# EAGLE design beteigeuze7 (EAGLE 4.16)
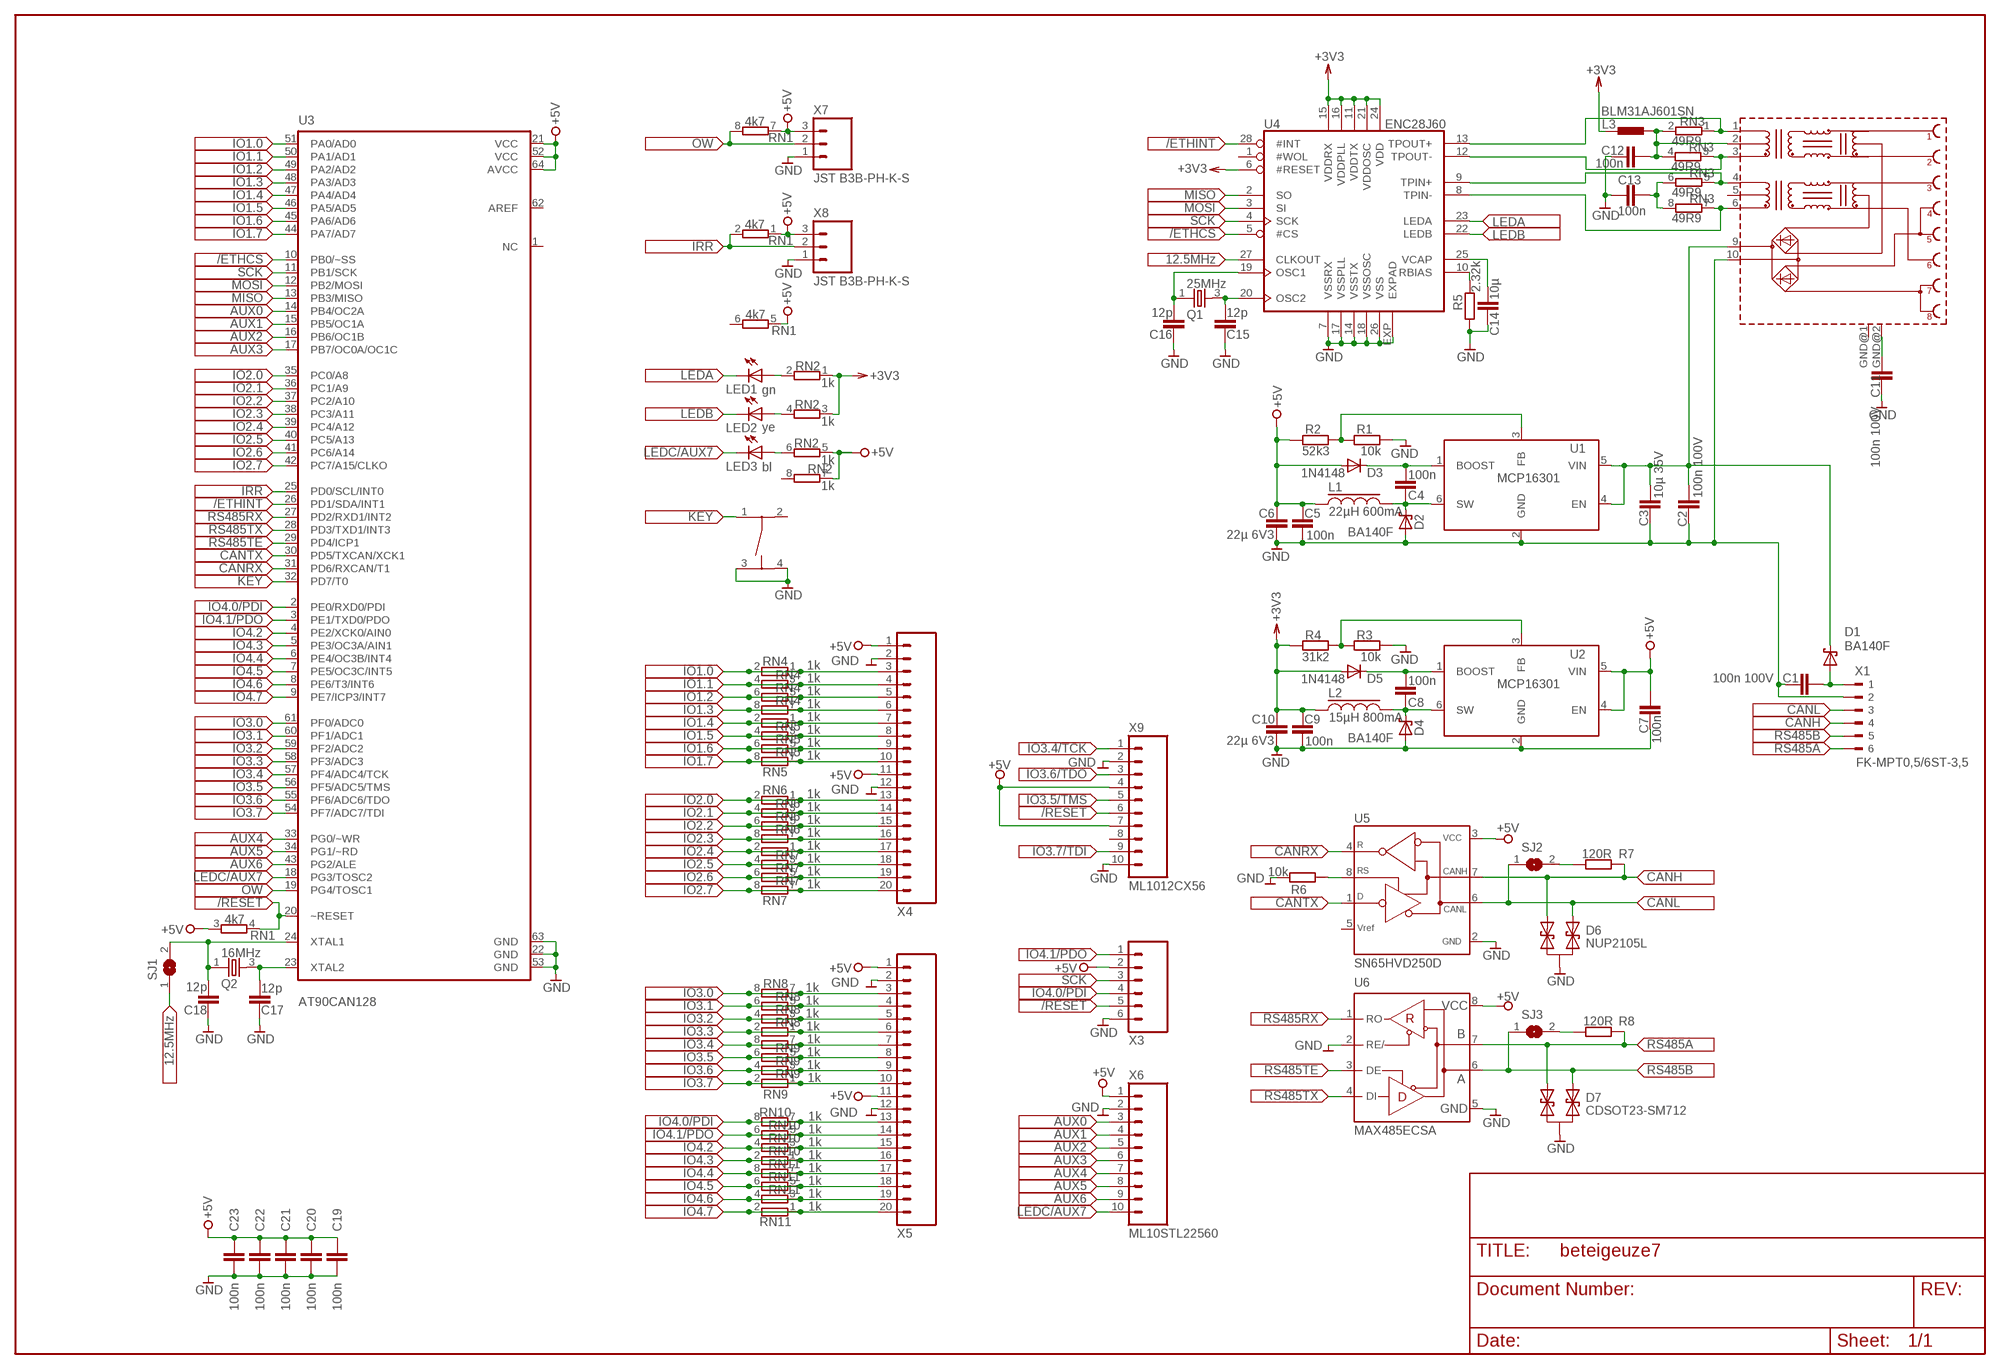
[diagram p0: schematic, sheet 1]

## Parts
C1  100n 100V  C-EUC1206  [C1206]
C2  100n 100V  C-EUC1206  [C1206]
C3  10µ 35V  C-EUC1210  [C1210]
C4  100n  C-EUC0603  [C0603]
C5  100n  C-EUC0603  [C0603]
C6  22µ 6V3  C-EUC0805  [C0805]
C7  100n  C-EUC0603  [C0603]
C8  100n  C-EUC0603  [C0603]
C9  100n  C-EUC0603  [C0603]
C10  22µ 6V3  C-EUC0805  [C0805]
C11  100n 100V  C-EUC1206  [C1206]
C12  100n  C-EUC0603  [C0603]
C13  100n  C-EUC0603  [C0603]
C14  10µ  C-EUC0603  [C0603]
C15  12p  C-EUC0603  [C0603]
C16  12p  C-EUC0603  [C0603]
C17  12p  C-EUC0603  [C0603]
C18  12p  C-EUC0603  [C0603]
C19  100n  C-EUC0603  [C0603]
C20  100n  C-EUC0603  [C0603]
C21  100n  C-EUC0603  [C0603]
C22  100n  C-EUC0603  [C0603]
C23  100n  C-EUC0603  [C0603]
D1  BA140F  SCHOTTKY-DIODESMA  [SMA]
D2  BA140F  SCHOTTKY-DIODESMA  [SMA]
D3  1N4148  DIODE-SOD323-R  [SOD323-R]
D4  BA140F  SCHOTTKY-DIODESMA  [SMA]
D5  1N4148  DIODE-SOD323-R  [SOD323-R]
D6  NUP2105L  [SOT23]
D7  CDSOT23-SM712  NUP2105L  [SOT23]
L1  22µH 600mA  SRN3015  [SRN3015]
L2  15µH 800mA  SRN3015  [SRN3015]
L3  BLM31AJ601SN  L-EUL1206  [C1206K]
LED1  gn  LEDCHIPLED_0805_GN  [CHIPLED_0805_GN]
LED2  ye  LEDCHIPLED_0805_GE  [CHIPLED_0805_GE]
LED3  bl  LEDCHIPLED_0805_BL  [CHIPLED_0805_BL]
Q1  25MHz  QXO32  [XO32]
Q2  16MHz  QXO32  [XO32]
R1  10k  R-EU_R0603  [R0603]
R2  52k3  R-EU_R0603  [R0603]
R3  10k  R-EU_R0603  [R0603]
R4  31k2  R-EU_R0603  [R0603]
R5  2.32k  R-EU_R0603  [R0603]
R6  10k  R-EU_R0603  [R0603]
R7  120R  R-EU_R0603  [R0603]
R8  120R  R-EU_R0603  [R0603]
RN1  4k7  E4RP  [BCN16]
RN2  1k  E4RP  [BCN16]
RN3  49R9  E4RP  [BCN16]
RN4  1k  E4RP  [BCN16]
RN5  1k  E4RP  [BCN16]
RN6  1k  E4RP  [BCN16]
RN7  1k  E4RP  [BCN16]
RN8  1k  E4RP  [BCN16]
RN9  1k  E4RP  [BCN16]
RN10  1k  E4RP  [BCN16]
RN11  1k  E4RP  [BCN16]
SJ1  SJN  [SJJ]
SJ2  SJN  [SJJ]
SJ3  SJN  [SJJ]
SW1  MENTOR1254PHAP3301A  [PHAP3301A]
U1  MCP16301  [SOT23-6L]
U2  MCP16301  [SOT23-6L]
U3  AT90CAN128  AT90CAN16AU  [TQFP64]
U4  ENC28J60  ENC28J60I/ML  [QNF28]
U5  SN65HVD250D  SN65HVD230DESA  [SO8]
U6  MAX485ECSA  MAX3072ECSA  [SO8]
X1  FK-MPT0,5/6ST-3,5  [FK-MPT0,5/6ST-3,5]
X2  WE7499210001AX-NUPS  [WE7499210001AX]
X3  ML6M  [STL22-560LPGGG6]
X4  ML20STL22-560  [STL22-560LPGGG20]
X5  ML20STL22-560  [STL22-560LPGGG20]
X6  ML10STL22560  [STL22-560LPGGG10]
X7  JST B3B-PH-K-S  CON03PPH-K-S  [B3B-PH-K-S]
X8  JST B3B-PH-K-S  CON03PPH-K-S  [B3B-PH-K-S]
X9  ML1012CX56  [12CX56-010G]

## Nets
12.5MHZ: SJ1.1 U4.27(CLKOUT)
+3V3: C9.2 C10.2 D5.A L2.1 L3.1 R4.2 RN2.1 RN2.3 U4.6(#RESET) U4.11(VDDTX) U4.15(VDDRX) U4.16(VDDPLL) U4.21(VDDOSC) U4.24(VDD)
+5V: C5.2 C6.2 C7.2 C19.2 C20.2 C21.2 C22.2 C23.2 D3.A L1.1 R2.2 RN1.1 RN1.3 RN1.5 RN1.7 RN2.5 RN2.7 U2.4(EN) U2.5(VIN) U3.21(VCC) U3.52(VCC) U3.64(AVCC) U5.3(VCC) U6.8(VCC) X3.2 X4.1 X4.11 X5.1 X5.11 X6.1 X7.3 X8.3 X9.4 X9.7
/ETHCS: U3.10(PB0/~SS) U4.5(#CS)
/ETHINT: U3.26(PD1/SDA/INT1) U4.28(#INT)
/RESET: RN1.4 U3.20(~RESET) X3.5 X9.6
AUX0: U3.14(PB4/OC2A) X6.3
AUX1: U3.15(PB5/OC1A) X6.4
AUX2: U3.16(PB6/OC1B) X6.5
AUX3: U3.17(PB7/OC0A/OC1C) X6.6
AUX4: U3.33(PG0/~WR) X6.7
AUX5: U3.34(PG1/~RD) X6.8
AUX6: U3.43(PG2/ALE) X6.9
BST3: C8.2 D5.C U2.1(BOOST)
BST5: C4.2 D3.C U1.1(BOOST)
CANH: D6.1 R7.2 U5.7(CANH) X1.4
CANL: D6.2 SJ2.1 U5.6(CANL) X1.3
CANRX: U3.31(PD6/RXCAN/T1) U5.4(R)
CANTX: U3.30(PD5/TXCAN/XCK1) U5.1(D)
FB3: R3.2 R4.1 U2.3(FB)
FB5: R1.2 R2.1 U1.3(FB)
GND: C1.1 C2.2 C3.1 C5.1 C6.1 C7.1 C9.1 C10.1 C11.1 C12.1 C13.1 C14.1 C15.1 C16.1 C17.1 C18.1 C19.1 C20.1 C21.1 C22.1 C23.1 D2.A D4.A D6.3 D7.3 R1.1 R3.1 R5.1 R6.2 SW1.3(A) SW1.4(A) U1.2(GND) U2.2(GND) U3.22(GND) U3.53(GND) U3.63(GND) U4.7(VSSRX) U4.14(VSSTX) U4.17(VSSPLL) U4.18(VSSOSC) U4.26(VSS) U4.EXP(EXPAD) U5.2(GND) U6.2(RE/) U6.5(GND) X1.2 X2.10(VC1-) X3.6 X4.2 X4.12 X5.2 X5.12 X6.2 X7.1 X8.1 X9.2 X9.10
IO1.0: RN4.1 RN4.2 U3.51(PA0/AD0) X4.3
IO1.1: RN4.3 RN4.4 U3.50(PA1/AD1) X4.4
IO1.2: RN4.5 RN4.6 U3.49(PA2/AD2) X4.5
IO1.3: RN4.7 RN4.8 U3.48(PA3/AD3) X4.6
IO1.4: RN5.1 RN5.2 U3.47(PA4/AD4) X4.7
IO1.5: RN5.3 RN5.4 U3.46(PA5/AD5) X4.8
IO1.6: RN5.5 RN5.6 U3.45(PA6/AD6) X4.9
IO1.7: RN5.7 RN5.8 U3.44(PA7/AD7) X4.10
IO2.0: RN6.1 RN6.2 U3.35(PC0/A8) X4.13
IO2.1: RN6.3 RN6.4 U3.36(PC1/A9) X4.14
IO2.2: RN6.5 RN6.6 U3.37(PC2/A10) X4.15
IO2.3: RN6.7 RN6.8 U3.38(PC3/A11) X4.16
IO2.4: RN7.1 RN7.2 U3.39(PC4/A12) X4.17
IO2.5: RN7.3 RN7.4 U3.40(PC5/A13) X4.18
IO2.6: RN7.5 RN7.6 U3.41(PC6/A14) X4.19
IO2.7: RN7.7 RN7.8 U3.42(PC7/A15/CLKO) X4.20
IO3.0: RN8.7 RN8.8 U3.61(PF0/ADC0) X5.3
IO3.1: RN8.5 RN8.6 U3.60(PF1/ADC1) X5.4
IO3.2: RN8.3 RN8.4 U3.59(PF2/ADC2) X5.5
IO3.3: RN8.1 RN8.2 U3.58(PF3/ADC3) X5.6
IO3.4: RN9.7 RN9.8 U3.57(PF4/ADC4/TCK) X5.7 X9.1
IO3.5: RN9.5 RN9.6 U3.56(PF5/ADC5/TMS) X5.8 X9.5
IO3.6: RN9.3 RN9.4 U3.55(PF6/ADC6/TDO) X5.9 X9.3
IO3.7: RN9.1 RN9.2 U3.54(PF7/ADC7/TDI) X5.10 X9.9
IO4.0/PDI: RN10.7 RN10.8 U3.2(PE0/RXD0/PDI) X3.4 X5.13
IO4.1/PDO: RN10.5 RN10.6 U3.3(PE1/TXD0/PDO) X3.1 X5.14
IO4.2: RN10.3 RN10.4 U3.4(PE2/XCK0/AIN0) X5.15
IO4.3: RN10.1 RN10.2 U3.5(PE3/OC3A/AIN1) X5.16
IO4.4: RN11.7 RN11.8 U3.6(PE4/OC3B/INT4) X5.17
IO4.5: RN11.5 RN11.6 U3.7(PE5/OC3C/INT5) X5.18
IO4.6: RN11.3 RN11.4 U3.8(PE6/T3/INT6) X5.19
IO4.7: RN11.1 RN11.2 U3.9(PE7/ICP3/INT7) X5.20
IRR: RN1.2 U3.25(PD0/SCL/INT0) X8.2
KEY: SW1.1(B) U3.32(PD7/T0)
LEDA: LED1.C U4.23(LEDA)
LEDB: LED2.C U4.22(LEDB)
LEDC/AUX7: LED3.C U3.18(PG3/TOSC2) X6.10
MISO: U3.13(PB3/MISO) U4.2(SO)
MOSI: U3.12(PB2/MOSI) U4.3(SI)
N$4: LED3.A RN2.6
N$7: C12.2 L3.2 RN3.2 RN3.4 X2.2(TCT)
N$8: C13.2 RN3.6 RN3.8
N$23: R6.1 U5.8(RS)
N$24: R7.1 SJ2.2
N$25: LED1.A RN2.2
N$26: R8.1 SJ3.2
N$29: LED2.A RN2.4
OSC1: C16.2 Q1.1 U4.19(OSC1)
OSC2: C15.2 Q1.3 U4.20(OSC2)
OW: RN1.8 U3.19(PG4/TOSC1) X7.2
RBIAS: R5.2 U4.10(RBIAS)
RS485A: D7.1 R8.2 U6.7(B) X1.6
RS485B: D7.2 SJ3.1 U6.6(A) X1.5
RS485RX: U3.27(PD2/RXD1/INT2) U6.1(RO)
RS485TE: U3.29(PD4/ICP1) U6.3(DE)
RS485TX: U3.28(PD3/TXD1/INT3) U6.4(DI)
SCK: U3.11(PB1/SCK) U4.4(SCK) X3.3
SHLD: C11.2 X2.GND@2(SHLD)
SW3: C8.1 D4.C L2.2 U2.6(SW)
SW5: C4.1 D2.C L1.2 U1.6(SW)
TPIN+: RN3.5 U4.9(TPIN+) X2.4(RX+)
TPIN-: RN3.7 U4.8(TPIN-) X2.6(RX-)
TPOUT+: RN3.1 U4.13(TPOUT+) X2.1(TX+)
TPOUT-: RN3.3 U4.12(TPOUT-) X2.3(TX-)
VCAP: C14.2 U4.25(VCAP)
VIN: C2.1 C3.2 D1.C U1.4(EN) U1.5(VIN) X2.9(VC1+)
VSUP: C1.2 D1.A X1.1
XTAL1: C18.2 Q2.1 SJ1.2 U3.24(XTAL1)
XTAL2: C17.2 Q2.3 U3.23(XTAL2)
Unconnected: RN1.6 RN2.8 SW1.2(B) U3.1(NC) U3.62(AREF) U4.1(#WOL) U5.5(VREF) X2.5(RCT) X2.GND@1(SHLD) X9.8

## Library data of the parts
C1-C23 = rcl:C-EU: CAPACITOR, European symbol
D1 D2 D4 = diode:SCHOTTKY-DIODE: Schottky Diode
D3 D5 = diode:DIODE-: DIODE
D6 D7 = _frank:NUP2105L
L1 L2 = inductor-bourns:SRN
L3 = rcl:L-EU: INDUCTOR, European symbol
LED1-LED3 = led:LED: LED OSRAM: - CHIPLED LG R971, LG N971, LY N971, LG Q971, LY Q971, LO R971, LY R971 LH N974, LH R974 LS Q976, LO Q976, LY Q976 LO Q996 - Hyper CHIPLED LW Q18S LB Q993, LB Q99A, LB R99A - SideLED LS A670, LO A670, LY A670, LG A670, LP A670 LB A673, LV A673, LT A673, LW A673 LH A674 LY A675 LS A676, LA A676, LO A676, LY A676, LW A676 LS A679, LY A679, LG A679 - Hyper Micro SIDELED® LS Y876, LA Y876, LO Y876, LY Y876 LT Y87S - SmartLED LW L88C, LW L88S LB L89C, LB L89S, LG L890 LS L89K, LO L89K, LY L89K LS L896, LA L896, LO L896, LY L896 - TOPLED LS T670, LO T670, LY T670, LG T670, LP T670 LSG T670, LSP T670, LSY T670, LOP T670, LYG T670 LG T671, LOG T671, LSG T671 LB T673, LV T673, LT T673, LW T673 LH T674 LS T676, LA T676, LO T676, LY T676, LB T676, LH T676, LSB T676, LW T676 LB T67C, LV T67C, LT T67C, LS T67K, LO T67K, LY T67K, LW E67C LS E67B, LA E67B, LO E67B, LY E67B, LB E67C, LV E67C, LT E67C LW T67C LS T679, LY T679, LG T679 LS T770, LO T770, LY T770, LG T770, LP T770 LB T773, LV T773, LT T773, LW T773 LH T774 LS E675, LA E675, LY E675, LS T675 LS T776, LA T776, LO T776, LY T776, LB T776 LHGB T686 LT T68C, LB T68C - Hyper Mini TOPLED® LB M676 - Mini TOPLED Santana® LG M470 LS M47K, LO M47K, LY M47K Source: http://www.osram.convergy.de - LUMILED® LXK2-PW12-R00, LXK2-PW12-S00, LXK2-PW14-U00, LXK2-PW14-V00 LXK2-PM12-R00, LXK2-PM12-S00, LXK2-PM14-U00 LXK2-PE12-Q00, LXK2-PE12-R00, LXK2-PE12-S00, LXK2-PE14-T00, LXK2-PE14-U00 LXK2-PB12-K00, LXK2-PB12-L00, LXK2-PB12-M00, LXK2-PB14-N00, LXK2-PB14-P00, LXK2-PB14-Q00 LXK2-PR12-L00, LXK2-PR12-M00, LXK2-PR14-Q00, LXK2-PR14-R00 LXK2-PD12-Q00, LXK2-PD12-R00, LXK2-PD12-S00 LXK2-PH12-R00, LXK2-PH12-S00 LXK2-PL12-P00, LXK2-PL12-Q00, LXK2-PL12-R00 Source: www.luxeon.com
Q1 Q2 = _frank:Q: CRYSTAL
R1-R8 = rcl:R-EU_: RESISTOR, European symbol
RN1-RN11 = _frank:E4RP: SIL RESISTOR
SJ1-SJ3 = jumper:SJ: SMD solder JUMPER
SW1 = switch:MENTOR1254
U1 U2 = _frank:MCP16301
U3 = AT90CAN:AT90CAN
U4 = ENC28J60:ENC28J60
U5 = _frank:SN65HVD230D: CANBUS TRANSEIVER
U6 = _frank:MAX3072E
X1 = con-phoenix-fkmpt35:FK-MPT0,5/6ST-3,5
X2 = _frank:WE7499210001A
X3 = con-harting-ml:ML6: HARTING
X4 X5 = con-harting-ml:ML20: HARTING
X6 X9 = con-harting-ml:ML10: HARTING
X7 X8 = _frank:CON03P

## Net classes
1 power: width 0.15 mm, drill 0.5 mm, clearance 0.3 mm
2 gnd-vcc: width 0.15 mm, drill 0.15 mm, clearance 0.3 mm

## Board
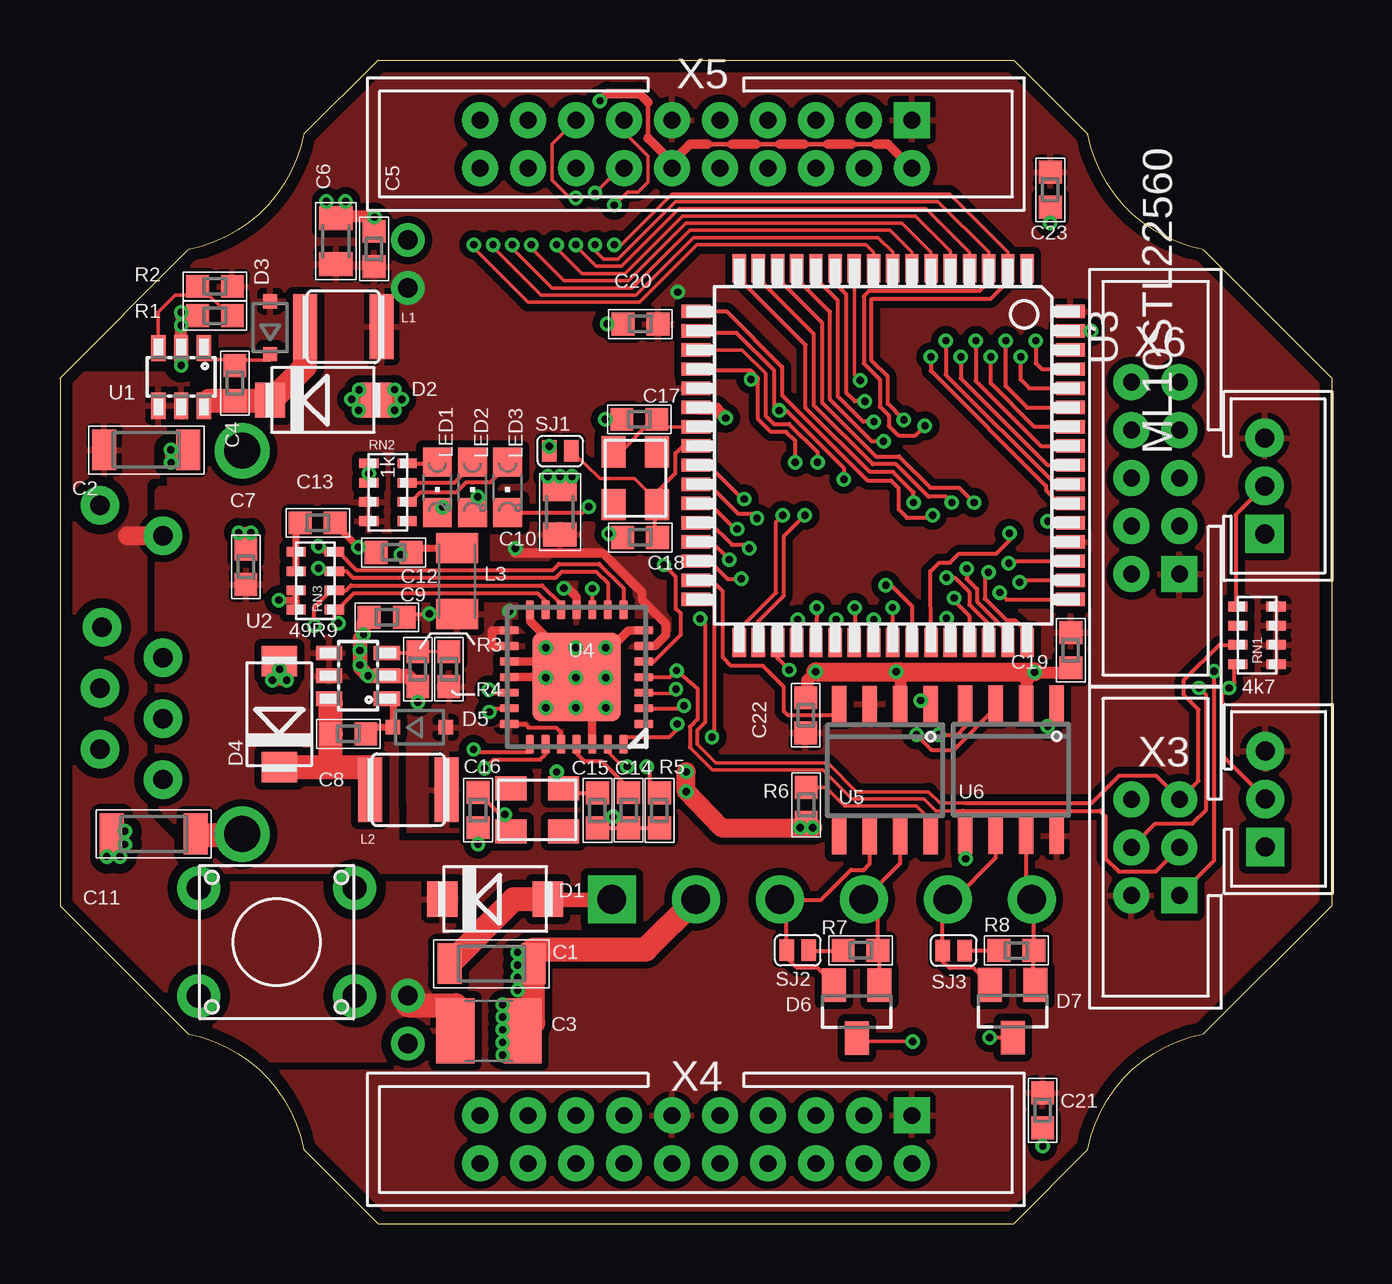
[diagram p1: board, top side]
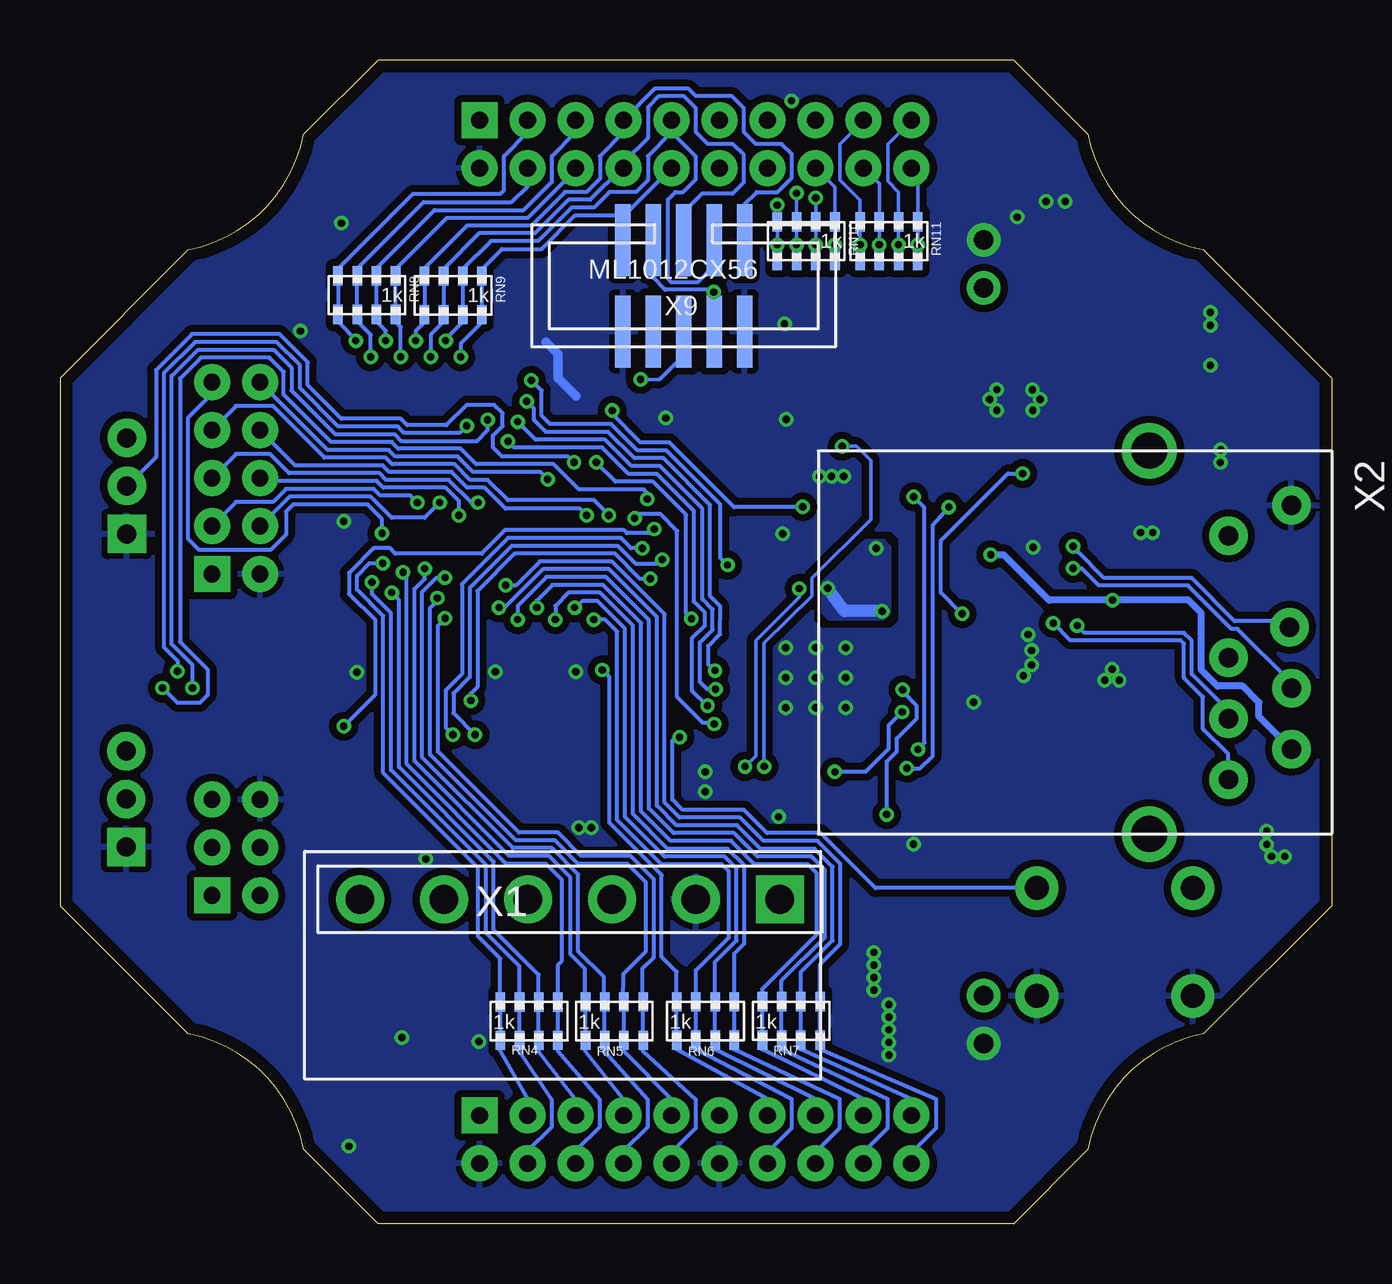
[diagram p2: board, bottom side, seen from below]

Size 53 x 48.5 mm. Coordinates in mm from the lower left corner, seen from the top.
Outline: 39.75,48.5 42.85,45.4 arc69 47.65,40.6 53,35.25 53,13.25 47.65,7.9 arc69 42.85,3.1 39.75,0 13.25,0 10.15,3.1 arc69 5.35,7.9 0,13.25 0,35.25 5.35,40.6 arc69 10.15,45.4 13.25,48.5 39.75,48.5
Copper layers (1*16): Top 0.035mm / dielectric 1.5mm / Bottom 0.035mm
Design rules "default": minimum track width 0.15mm, minimum drill 0.3mm, track to track 0.15mm, track to pad 0.15mm, pad to pad 0.15mm, via to via 0.15mm, smd to smd 0mil, copper to edge 20mil, drill to drill 8mil, minimum pad ring 0.4mm, minimum via ring 0.15mm, stop-mask expansion 6mil, vias tented up to drill 13mil, thermal gap 10mil

### Footprints (pad centres in the part's own frame; a part is rotated, then mirrored left to right if it is on the bottom)
C1206 = smd 1 x 1.7: 1 -1.75,0; 2 1.75,0
C1210 = smd 1.6 x 2.7: 1 -1.4,0; 2 1.4,0
C0603 = smd 0.95 x 0.95: 1 -0.731,0; 2 0.731,0
C0805 = smd 1 x 1.4: 1 -0.95,0; 2 0.95,0
SMA = smd 1.27 x 1.473: A 2.2,0; C -2.2,0
SOD323-R = smd 0.6 x 0.6: A 1.1,0; C -1.1,0
SOT23 = smd 1 x 1.4: 1 -0.95,-1.1; 2 0.95,-1.1; 3 0,1.1
SRN3015 = smd 2.7 x 1: 1 0,1.6; 2 0,-1.6
C1206K = smd 1.25 x 1.75: 1 -1.375,0; 2 1.375,0
CHIPLED_0805_GN = smd 1.2 x 1.2: A 0,-1.05; C 0,1.05
CHIPLED_0805_GE = smd 1.2 x 1.2: A 0,-1.05; C 0,1.05
CHIPLED_0805_BL = smd 1.2 x 1.2: A 0,-1.05; C 0,1.05
XO32 = smd 1.3 x 1: 1 -1.1,-0.9; 2 1.1,-0.9; 3 1.1,0.9; 4 -1.1,0.9
R0603 = smd 0.95 x 0.95: 1 -0.725,0; 2 0.725,0
BCN16 = smd 0.4 x 0.8: 1 -1.2,-0.8; 2 -1.2,0.8; 3 -0.4,-0.8; 4 -0.4,0.8; 5 0.4,-0.8; 6 0.4,0.8; 7 1.2,-0.8; 8 1.2,0.8
SJJ = smd 0.6 x 0.9: 1 -0.462,0; 2 0.462,0
PHAP3301A = drill 1 pad 1.4 round: 1 -3.25,-2.25; 2 3.25,-2.25; 3 -3.25,2.25; 4 3.25,2.25
SOT23-6L = smd 0.6 x 1.1: 1 -0.95,-1.2; 2 0,-1.2; 3 0.95,-1.2; 4 0.95,1.2; 5 0,1.2; 6 -0.95,1.2
TQFP64 = smd 1.2 x 0.56: 1 -7.8,6; 2 -7.8,5.2; 3 -7.8,4.4; 4 -7.8,3.6; 5 -7.8,2.8; 6 -7.8,2; 7 -7.8,1.2; 8 -7.8,0.4; 9 -7.8,-0.4; 10 -7.8,-1.2; 11 -7.8,-2; 12 -7.8,-2.8; 13 -7.8,-3.6; 14 -7.8,-4.4; 15 -7.8,-5.2; 16 -7.8,-6; 33 7.8,-6; 34 7.8,-5.2; 35 7.8,-4.4; 36 7.8,-3.6; 37 7.8,-2.8; 38 7.8,-2; 39 7.8,-1.2; 40 7.8,-0.4; 41 7.8,0.4; 42 7.8,1.2; 43 7.8,2; 44 7.8,2.8; 45 7.8,3.6; 46 7.8,4.4; 47 7.8,5.2; 48 7.8,6 | smd 0.56 x 1.2: 17 -6,-7.8; 18 -5.2,-7.8; 19 -4.4,-7.8; 20 -3.6,-7.8; 21 -2.8,-7.8; 22 -2,-7.8; 23 -1.2,-7.8; 24 -0.4,-7.8; 25 0.4,-7.8; 26 1.2,-7.8; 27 2,-7.8; 28 2.8,-7.8; 29 3.6,-7.8; 30 4.4,-7.8; 31 5.2,-7.8; 32 6,-7.8; 49 6,7.8; 50 5.2,7.8; 51 4.4,7.8; 52 3.6,7.8; 53 2.8,7.8; 54 2,7.8; 55 1.2,7.8; 56 0.4,7.8; 57 -0.4,7.8; 58 -1.2,7.8; 59 -2,7.8; 60 -2.8,7.8; 61 -3.6,7.8; 62 -4.4,7.8; 63 -5.2,7.8; 64 -6,7.8
QNF28 = smd 0.8 x 0.35: 1 -2.8,1.95; 2 -2.8,1.3; 3 -2.8,0.65; 4 -2.8,0; 5 -2.8,-0.65; 6 -2.8,-1.3; 7 -2.8,-1.95; 15 2.8,-1.95; 16 2.8,-1.3; 17 2.8,-0.65; 18 2.8,0; 19 2.8,0.65; 20 2.8,1.3; 21 2.8,1.95 | smd 0.35 x 0.8: 8 -1.95,-2.8; 9 -1.3,-2.8; 10 -0.65,-2.8; 11 0,-2.8; 12 0.65,-2.8; 13 1.3,-2.8; 14 1.95,-2.8; 22 1.95,2.8; 23 1.3,2.8; 24 0.65,2.8; 25 0,2.8; 26 -0.65,2.8; 27 -1.3,2.8; 28 -1.95,2.8 | smd 3.7 x 3.7: EXP 0,0
SO8 = smd 0.6 x 1.5: 1 -1.905,-2.759; 2 -0.635,-2.759; 3 0.635,-2.759; 4 1.905,-2.759; 5 1.905,2.759; 6 0.635,2.759; 7 -0.635,2.759; 8 -1.905,2.759
FK-MPT0,5/6ST-3,5 = drill 1.2 pad 2 square: 1 -8.75,0 | drill 1.2 pad 2 round: 2 -5.25,0; 3 -1.75,0; 4 1.75,0; 5 5.25,0; 6 8.75,0
WE7499210001AX = drill 0.8 pad 1.4 round: 1 5.715,6.35; 2 4.445,8.97; 3 3.175,6.35; 4 1.905,8.97; 5 0.635,6.35; 6 -0.635,8.89; 9 -4.445,6.35; 10 -5.715,8.97 | drill 1.5 round: GND@1 -7.99,3.046; GND@2 7.99,3.046
STL22-560LPGGG6 = drill 0.7 square: 1 -2,-1 | drill 0.7 round: 2 -2,1; 3 0,-1; 4 0,1; 5 2,-1; 6 2,1
STL22-560LPGGG20 = drill 0.7 square: 1 -9,-1 | drill 0.7 round: 2 -9,1; 3 -7,-1; 4 -7,1; 5 -5,-1; 6 -5,1; 7 -3,-1; 8 -3,1; 9 -1,-1; 10 -1,1; 11 1,-1; 12 1,1; 13 3,-1; 14 3,1; 15 5,-1; 16 5,1; 17 7,-1; 18 7,1; 19 9,-1; 20 9,1
STL22-560LPGGG10 = drill 0.7 square: 1 -4,-1 | drill 0.7 round: 2 -4,1; 3 -2,-1; 4 -2,1; 5 0,-1; 6 0,1; 7 2,-1; 8 2,1; 9 4,-1; 10 4,1
B3B-PH-K-S = drill 0.8 pad 1.4 square: 1 0,-2 | drill 0.8 pad 1.4 round: 2 0,0; 3 0,2
12CX56-010G = smd 0.65 x 3: 1 -2.54,-1.905; 2 -2.54,1.905; 3 -1.27,-1.905; 4 -1.27,1.905; 5 0,-1.905; 6 0,1.905; 7 1.27,-1.905; 8 1.27,1.905; 9 2.54,-1.905; 10 2.54,1.905

### Placement (x,y rotation side)
C1  17.98,10.83 180 top
C2  3.6,32.25 0 top
C3  17.88,8.03 180 top
C4  7.29,35.03 90 top
C5  13.09,40.62 270 top
C6  11.5,40.95 270 top
C7  7.75,27.37 270 top
C8  12.02,20.41 0 top
C9  13.62,25.27 0 top
C10  20.84,29.66 270 top
C11  3.9,16.24 0 top
C12  13.9,27.98 0 top
C13  10.74,29.21 180 top
C14  23.7,17.23 90 top
C15  22.4,17.22 90 top
C16  17.43,17.23 90 top
C17  24.14,33.52 0 top
C18  24.18,28.6 0 top
C19  42.13,23.9 90 top
C20  24.2,37.49 0 top
C21  40.95,4.72 90 top
C22  31.08,21.18 270 top
C23  41.27,43.09 90 top
D1  18.14,13.52 0 top
D2  10.96,34.32 0 top
D3  8.76,37.34 90 top
D4  9.14,21.23 90 top
D5  14.98,20.68 0 top
D6  33.21,8.83 180 top
D7  39.71,8.85 180 top
L1  11.81,37.38 270 top
L2  14.52,18.08 270 top
L3  16.56,26.78 90 top
LED1  15.73,30.69 180 top
LED2  17.19,30.69 180 top
LED3  18.66,30.69 180 top
Q1  19.89,17.25 0 top
Q2  23.98,31.07 90 top
R1  6.46,37.84 0 top
R2  6.46,39.06 0 top
R3  14.92,23.11 90 top
R4  16.21,23.11 270 top
R5  24.98,17.22 90 top
R6  31.1,17.45 270 top
R7  33.37,11.39 0 top
R8  39.87,11.38 0 top
RN1  49.89,24.52 90 top
RN2  13.67,30.48 270 top
RN3  10.64,26.8 90 top
RN4  33.45,8.43 0 bottom
RN5  29.89,8.44 0 bottom
RN6  26.09,8.44 0 bottom
RN7  22.52,8.45 0 bottom
RN8  40.21,38.7 180 bottom
RN9  36.61,38.69 180 bottom
RN10  21.9,40.95 180 bottom
RN11  18.45,40.95 180 bottom
SJ1  20.85,32.2 0 top
SJ2  30.75,11.39 0 top
SJ3  37.25,11.38 0 top
SW1  9.03,11.73 180 top
U1  5.05,35.29 180 top
U2  12.42,22.83 90 top
U3  34.31,32.02 270 top
U4  21.54,22.77 180 top
U5  34.39,18.9 180 top
U6  39.64,18.92 180 top
X1  31.75,13.52 180 bottom
X2  10.64,24.22 270 bottom
X3  45.66,15.68 90 top
X4  26.5,3.5 180 top
X5  26.5,44.99 180 top
X6  45.66,31.07 90 top
X7  50.22,30.75 0 top
X8  50.24,17.7 0 top
X9  27,39.09 180 bottom

### Tracks (layer width: path | path; a pad name or v marks a point on that pad's centre or on a via)
12.5MHZ  (via drill 0.3 pad 0.6)
  Top 0.15: v23.65,19.05 23.45,19.05 22.84,19.66 U4.27 | SJ1.1 20.39,32.24 v20.4,32.4
  Bottom 0.15: v23.65,19.05 23.65,24.2 21.65,26.15 21.65,26.9 19.2,29.35 19.2,31.8 19.8,32.4 v20.4,32.4
+3V3  (via drill 0.3)
  Top 0.16: U4.21 19.38,20.82 19.52,20.68 20.68,20.68 20.88,20.48 20.88,19.98 U4.24 | RN2.3 | RN2.3 | RN2.1 12.87,31.44 v12.88,31.26 v12.87,31.26 RN2.3 | 14.71,25.42 14.71,25.41 v15.4,25.41
  Top 0.35: U4.11 21.54,26.11 21.18,26.47 v21,26.48 | U4.6 24.8,24.07 25.25,24.52 25.25,25 24.25,26 24.25,26.32 22.62,27.95 | U4.15 18,24.73 18,24.07 U4.16 | 22.62,27.95 22.52,27.95 20.12,27.95 | 22.62,27.95 24.05,26.5
  Top 0.4: 22.52,27.95 18.98,27.95 v18.98,28.15
  Bottom 0.16: v12.88,31.26 13.49,31.26 16.25,28.5 16.29,28.46 16.29,26.3 v15.4,25.41
  Bottom 0.5: v21,26.48 20.3,25.52 v18.73,25.52
  pour Top (isolate 0.3): 14.5,27.5 18,27.5 18,29.25 22.75,29.25 22.75,28.25 27,28.25 27,20 16.79,19.99 16.79,16.34 14.53,16.33 14.49,21.39
  pour Bottom (isolate 0.3, no thermals): 18.43,25.48 18.43,28.2 18.68,28.45 19.9,28.45 21.2,27.15 21.2,25.48 20.95,25.23 18.68,25.23
+5V  (via drill 0.3, 0.8 pad 1.4)
  Bottom 0.16: X9.7 28.27,39.42 27.77,38.92 25.85,38.92 v25.75,38.83 25.75,37.2 X9.4 | X9.4 | X9.4
  other vias: 14.5,39
  pour Top (isolate 0.3, rank 2): 0,35.25 13.25,48.5 39.75,48.5 53,35.25 53,13.25 39.75,0 13.25,0 0,13.25
/ETHCS  (via drill 0.3)
  Top 0.15: U3.10 33.11,35.39 v33.35,35.15
  Top 0.16: v25.18,27.45 25.68,26.95 25.68,25.62 25.88,25.43 25.88,24.55 24.75,23.43 U4.5
  Bottom 0.16: v25.18,27.45 25.48,27.75 25.48,29.98 27.73,32.23 28.93,32.23 30.02,33.33 32.58,33.33 32.92,33.67 32.92,34.73 v33.35,35.15
/ETHINT  (via drill 0.3)
  Top 0.16: U3.26 27.02,30.83 28.27,29.57 28.88,29.57 v29.05,29.4 | v25.73,20.82 25.73,20.6 25.4,20.27 23.48,20.27 U4.28
  Bottom 0.16: v25.73,20.82 25.77,20.88 26.2,20.88 27.27,21.95 27.27,28.88 27.98,29.57 28.88,29.57 v29.05,29.4
/RESET  (via drill 0.3)
  Top 0.15: 26.57,19.98 27.35,19.2 32,19.2 33.2,18 36.2,18 36.67,17.52 37.75,17.52
  Top 0.16: X3.5 45.67,18.68 44.15,18.68 43,17.52 37.75,17.52 | v30.65,31.73 30.65,32.62 30.26,33 29.64,33 29.1,33.54 29.1,35.24 28.8,35.55 | X3.5 | 26.57,19.98 26.57,20.57 26.9,20.9 26.9,24.98 v26.68,25.2 | U3.20 26.55,35.56 26.55,35.55 28.8,35.55 | 28.8,35.55 v28.8,35.19 | X3.5 46.67,17.68 47.45,18.45 47.45,21.43 46.85,22.02 46.85,22.65 48.33,24.12 RN1.4
  Bottom 0.16: v26.68,25.2 26.9,25.43 26.9,29.55 28.27,30.93 29.85,30.93 v30.65,31.73 | X9.6 27,36.2 28,35.2 v28.8,35.19
AUX0  (via drill 0.3)
  Top 0.16: v38.1,30.05 37.48,30.68 36.27,30.68 34.98,31.98 34,31.98 31.77,34.2 31.77,37.52 29.98,39.32 U3.14
  Bottom 0.16: X6.3 45.66,30.07 44.12,30.07 43.58,30.62 39.92,30.62 39.65,30.35 38.4,30.35 v38.1,30.05
AUX1  (via drill 0.3)
  Top 0.16: v37.17,30.05 36.92,30.3 36.2,30.3 34.85,31.65 33.88,31.65 31.43,34.1 31.43,37.08 29.19,39.31 U3.15
  Bottom 0.16: X6.4 43.42,30.3 40.05,30.3 39.17,29.43 37.8,29.43 v37.17,30.05
AUX2  (via drill 0.3)
  Top 0.16: v35.58,30.05 35.58,30.48 34.73,31.32 33.75,31.32 31.07,34 31.07,36.62 28.33,39.37 U3.16
  Bottom 0.16: X6.5 45.66,32.08 44.25,32.08 43.45,31.27 39.67,31.27 39.4,31 36.8,31 35.85,30.05 v35.58,30.05
AUX3  (via drill 0.3)
  Top 0.16: v36.38,29.52 36.27,29.43 35.3,29.43 34.95,29.77 34.95,30.65 34.62,30.98 33.65,30.98 30.1,34.52 30.1,35.7 27.77,38.02 26.7,38.02 U3.17
  Bottom 0.16: v36.38,29.52 36.38,30.12 36.92,30.68 39.52,30.68 39.8,30.95 44.53,30.95 X6.6
AUX4  (via drill 0.3)
  Top 0.16: U3.33 28.39,24.84 29.85,26.3 29.85,29.25 v30.12,29.52
  Bottom 0.16: X6.7 45.66,34.08 44.12,34.08 41.98,31.93 39.42,31.93 39.15,31.65 36.55,31.65 35.9,31 35.17,31 34.33,30.15 30.75,30.15 v30.12,29.52
AUX5  (via drill 0.3)
  Top 0.16: U3.34 29.11,25.11 30.18,26.18 30.18,28.65 v31.05,29.52
  Bottom 0.16: v31.05,29.52 31.32,29.8 34.42,29.8 35.3,30.68 36.02,30.68 36.67,31.32 39.27,31.32 39.55,31.6 43.2,31.6 X6.8 | X6.8 | X6.8 44.67,33.08
AUX6  (via drill 0.3)
  Top 0.16: U3.43 36.28,27.18 36.65,27.55 37.1,27.55 37.48,27.93 39.02,27.93 39.58,28.48 v39.58,28.77
  Bottom 0.16: X6.9 46.66,34.59 47.65,33.6 47.65,28.52 47.2,28.07 44.23,28.07 43.58,28.73 43.58,29.68 43.27,29.98 40.17,29.98 39.58,29.38 v39.58,28.77 39.58,28.75
BST3
  Top 0.3: C8.2 13.02,20.68 D5.C 13.88,21.62 U2.1
BST5
  Top 0.15: U1.1 6,36.02 7.29,36.02 C4.2 7.29,36 8.76,36 D3.C
CANH
  Top 0.16: U5.7 35.02,15.03 33.5,13.5 | R7.2 34.1,11.77 | 33.5,13.5 X1.4 | R7.2 | D6.1 34.16,11.33 R7.2 | R7.2 | 33.5,13.5 34.1,12.9 R7.2
CANL
  Top 0.16: U5.6 33.76,15.01 33.5,14.75 32.98,14.75 31.73,13.5 30,13.5 X1.3 | SJ2.1 30.06,11.4 | SJ2.1 30.29,11.1 30.73,10.66 31.56,10.66 32.26,9.96 D6.2 | X1.3 | SJ2.1 30.28,13.23 X1.3
CANRX
  Top 0.16: U3.31 27.08,26.9 27.62,26.35 27.62,23.6 27.98,23.25 29.3,23.25 30.18,22.38 30.18,21.35 30.32,21.2 32.49,21.2 U5.4
CANTX  (via drill 0.3)
  Top 0.16: v28.4,26.88 27.82,26.88 27.02,27.68 U3.30 | 36.27,21.68 U5.1 | U5.1 | v35.88,21.8 36.3,21.8 U5.1
  Bottom 0.16: v28.4,26.88 28.82,26.88 29.88,27.93 34.05,27.93 35.6,26.38 35.6,22.38 35.88,22.1 v35.88,21.8
FB3
  Top 0.1: R3.2 16.18,23.84
  Top 0.15: R3.2 14.86,23.78 U2.3 | R4.1 16.2,23.84 16.19,23.84 16.18,23.84
FB5
  Top 0.15: U1.3 4.1,38 4.8,38.7 5.7,38.7 5.74,38.73 R2.1 5.85,39.06 7.07,37.84 R1.2
GND  (via drill 0.3, 0.3 pad 0.6, 0.8 pad 1.4)
  Top 0.15: 7.75,28.8 v7.96,28.8 | C5.1 v13.1,41.95 | R6.2 30.88,16.5 30.75,16.5 | 19.35,8.07 19.35,8.1 C3.1 | C20.1 v22.8,37.5
  Top 0.16: R5.1 23.76,16.49 23.75,16.5 23.74,16.49 C14.1 23.05,16.49 | 23.05,16.49 v23.05,16.95 | C15.1 22.49,16.49 22.5,16.5 22.51,16.49 23.05,16.49 | C16.1 v17.43,15.81 | C18.1 v22.88,28.75 | v22.73,33.52 C17.1 | C23.1 v41.27,41.7 | D6.3 33.21,7.58 v35.54,7.59 | C21.1 v40.95,3.23 v40.96,3.23 | D7.3 39.73,7.74 v38.75,7.75 | C1.1 v19.07,11.3 | C1.1 v19.07,10.78 | C1.1 v19.07,10.25 | C1.1 | C1.1 v19.07,9.72 | 19.73,8.38 v18.45,9.12 | 19.4,8.07 v18.45,8.6 | 19.4,8.07 19.35,8.07 v18.45,8.07 | 19.4,8.07 v18.45,7.55 | v18.45,7.03 19.4,8.07
  Top 0.18: 27,44.99 28.01,44.99 | 29,44.99 30.01,44.99 | 31,44.99 32.01,44.99 | 32.99,44.99 34.01,44.99 | 24.5,46.75 24.5,45.25
  Top 0.3: C13.1 11.66,29.21 11.44,29.19 v12.44,28.19 12.99,28.18 13.19,27.98 C12.1 13.43,28.15 13.41,28.16
  Top 0.35: 21.52,22.77 v21.5,22.75 21.48,22.77 U4.18 | U4.26 22.18,22.11 21.52,22.77 | U4.7 23.7,24.73 21.75,22.77 U4.EXP 21.52,22.77 | U4.17 20.88,23.43 21.18,23.12 | 21.52,22.77 21.18,23.12 | 21.18,23.12 21.38,23.32 19.59,25.11 U4.14 | U6.5 37.73,15.29 v37.75,15.2 | U3.53 41.23,29.26 v41.17,29.27 | C22.1 31.14,22.17 | 40.6,23 v40.62,22.98
  Top 0.4: U3.63 42.09,37.2 v42.98,37.2 | 27,44.99 26.5,44.99 | 28.01,44.99 29,44.99 | 30.01,44.99 31,44.99 | 32.01,44.99 32.99,44.99 | 34.01,44.99 34.51,44.99 X5.2 | 24.5,45.25 25.5,44.25 26.25,45 26.5,45 | v22.51,46.8 22.81,47.1 24.15,47.1 24.5,46.75
  Top 0.5: U3.22 26.56,33.98 27.35,33.98 v27.75,33.58 | U6.2 40.27,22.62 v40.62,22.98 41.92,22.98 C19.1 | 31.14,22.17 31.15,22.65 v31.5,23 | 35.02,23 U5.2 | X5.12 25.5,44.25 | R1.1 5.05,37.84 v5.05,37.98 | U1.2 v5.05,37.44 | v9.45,22.65 v8.85,22.65 | D4.A v9.15,23.1 | C7.1 7.75,28.8 | C5.1 13.09,42 11.5,42 C6.1 | C2.2 5.35,32.03 4.62,32.03 v4.62,32.25 | v12.15,34.35 v14.25,34.35 | v12.47,34.75 12.47,34.32 D2.A | C11.1 2.7,16.25 v2.7,16.35
  Top 0.6: U2.2 14.48,22.83 R3.1 v14.92,21.73 | U2.2 | U2.2 v12.84,22.83 12.5,23.17 v12.5,23.28 v12.5,23.89 12.5,24.4 v12.65,24.55 12.65,25.03 C9.1 | C10.1 v20.84,31.15
  Top 0.8: v31.5,23 v34.85,23 35.02,23 40.6,23 | v31.38,16.5 v30.85,16.5 30.75,16.5 27.57,16.5 26.1,18.02 v26.1,18.82
  Top 1: X1.2 24.41,11.43 19.73,11.43 19.73,10.85 | 19.73,10.85 C1.1 | 19.73,10.85 C1.1 19.73,8.38 19.4,8.07
  Bottom 0.4: 31.5,34.5 32.25,35.25 32.25,36.25 32.75,36.75
  other vias: 20.25,24 21.5,24 22.75,24 20.25,22.75 22.75,22.75 22.75,21.5 21.5,21.5 20.25,21.5 4.63,31.72 26.1,18 20.34,31.15 21.34,31.14 7.45,28.8 11.1,42.6 11.9,42.6 12.45,33.9 13.95,34.76 13.95,33.9 5.05,35.77 1.95,15.3 2.5,15.3 2.7,15.8 14.5,7.5 14.5,41
  pour Bottom (isolate 0.3, rank 2): 0,35.25 13.25,48.5 39.75,48.5 53,35.25 53,13.25 39.75,0 13.25,0 0,13.25
IO1.0  (via drill 0.3)
  Top 0.16: U3.51 39.63,27.61 v39.55,27.52
  Bottom 0.16: RN4.2 | RN4.2 34.65,11.05 35.58,11.97 35.58,14.82 39.52,18.77 39.52,25.32 40.62,26.43 40.62,27 40.1,27.52 v39.55,27.52 | X4.3 33.5,5.16 34.65,7.21 RN4.1 RN4.2
IO1.1  (via drill 0.3)
  Top 0.16: U3.50 40.12,26.82 v40,26.73
  Bottom 0.16: X4.4 33.51,3.03 32.5,4.03 32.5,5.16 33.85,7.18 RN4.3 RN4.4 33.85,10.72 35.25,12.12 35.25,14.95 39.2,18.9 39.2,25.45 40,26.25 v40,26.73
IO1.2  (via drill 0.3)
  Top 0.16: U3.49 39.47,26.01 v39.17,26.3
  Bottom 0.16: X4.5 31.5,5.16 33.05,7.18 RN4.5 RN4.6 33.05,10.38 34.92,12.25 34.92,15.07 38.88,19.02 38.88,26 v39.17,26.3
IO1.3  (via drill 0.3)
  Top 0.16: U3.48 40.22,24.73 39.8,25.15 39.45,25.15 38.55,26.05 38.55,27 v38.7,27.15
  Bottom 0.16: X4.6 31.5,3.03 30.5,4.03 30.5,5.16 32.25,7.18 RN4.7 RN4.8 32.25,10.78 32.08,10.95 32.08,14.32 32.75,15 34.4,15 38.55,19.15 38.55,27 v38.7,27.15
IO1.4  (via drill 0.3)
  Top 0.16: U3.47 39.43,24.72 38.23,25.93 38.23,26.45 37.8,26.88 v37.8,27.3
  Bottom 0.16: RN5.2 31.12,9.26 31.12,10.62 31.73,11.22 31.73,14.43 32.62,15.32 34.27,15.32 38.23,19.27 38.23,26.45 37.8,26.88 v37.8,27.3 | RN5.2 31.12,9.28 | X4.7 29.5,5.16 31.1,7.18 RN5.1 RN5.2
IO1.5  (via drill 0.3)
  Top 0.16: U3.46 38.72,24.98 37.9,25.8 37.9,26.32 37.3,26.93 v36.95,26.93
  Bottom 0.16: X4.8 29.5,3.03 28.5,4.03 28.5,5.16 30.3,7.18 RN5.3 RN5.4 30.32,9.27 30.32,10.28 31.4,11.35 31.4,14.55 32.5,15.65 34.12,15.65 37.9,19.43 37.9,26.32 37.3,26.93 v36.95,26.93
IO1.6  (via drill 0.3)
  Top 0.16: U3.45 37.9,25.32 37.27,25.95 v37.27,26.07
  Bottom 0.16: RN5.6 29.52,9.24 29.52,9.23 | 29.52,9.23 29.52,10.4 28.57,11.35 28.57,14.22 29.35,15 31.4,15 32.38,15.97 34,15.97 37.58,19.55 37.58,25.65 37.27,25.95 v37.27,26.07 | RN5.6 29.52,9.23 | 29.52,9.23 29.52,9.82 | X4.9 27.5,5.16 29.5,7.18 RN5.5 RN5.6
IO1.7  (via drill 0.3)
  Top 0.16: U3.44 37.07,25.11 v36.95,25.23
  Bottom 0.16: RN5.8 28.73,9.21 28.72,10.63 28.25,11.1 28.25,14.35 29.23,15.32 31.27,15.32 32.25,16.3 33.88,16.3 37.25,19.68 37.25,24.93 v36.95,25.23 | RN5.8 28.72,9.24 28.73,10.28 | X4.10 27.5,2.98 26.5,3.98 26.5,5.16 28.7,7.18 RN5.7 RN5.8
IO2.0  (via drill 0.3)
  Top 0.16: U3.35 29.9,23.57 v30.4,23.07
  Bottom 0.16: X4.13 23.5,5.18 27.3,7.26 RN6.1 RN6.2 27.3,10.5 27.93,11.12 27.93,14.53 30.1,16.7 30.1,22.77 v30.4,23.07
IO2.1  (via drill 0.3)
  Top 0.16: U3.36 30.77,25.16 v30.75,25.18
  Bottom 0.16: RN6.4 | X4.14 23.5,2.98 22.5,3.98 22.5,5.18 26.5,7.26 RN6.3 RN6.4 | v30.75,25.18 30.27,25.18 29.77,24.68 29.77,16.82 27.93,14.97 25.43,14.97 25.12,14.68 25.12,11.93 26.5,10.55 RN6.4
IO2.2  (via drill 0.3)
  Top 0.16: U3.37 31.55,25.62 v31.55,25.68
  Bottom 0.16: X4.15 21.5,5.18 25.7,7.26 RN6.5 RN6.6 25.7,10.9 24.8,11.8 24.8,14.8 25.3,15.3 27.8,15.3 29.45,16.95 29.45,24.8 30.6,25.95 31.2,25.95 v31.55,25.68
IO2.3  (via drill 0.3)
  Top 0.16: U3.38 32.34,25.17 v32.35,25.18
  Bottom 0.16: X4.16 21.5,2.98 20.5,3.98 20.5,5.18 24.9,7.26 RN6.7 RN6.8 24.89,11.26 24.48,11.68 24.48,14.93 25.18,15.62 27.68,15.62 29.12,17.07 29.12,24.93 30.5,26.3 31.8,26.3 32.35,25.75 v32.35,25.18
IO2.4  (via drill 0.3)
  Top 0.16: U3.39 33.13,25.62 v33.12,25.68
  Bottom 0.16: RN7.2 23.73,9.78 21.45,12.05 21.45,14.6 21.82,14.97 24.05,14.97 25.02,15.95 27.55,15.95 28.77,17.18 28.77,25.02 30.38,26.62 32.48,26.62 33.12,25.98 v33.12,25.68 | X4.17 19.5,5.18 23.73,7.26 RN7.1 RN7.2 | RN7.2
IO2.5  (via drill 0.3)
  Top 0.16: U3.40 33.92,25.17 v33.92,25.18
  Bottom 0.16: X4.18 19.5,2.98 18.5,3.98 18.5,5.18 22.93,7.26 RN7.3 RN7.4 22.92,10.13 21.12,11.93 21.12,14.75 21.68,15.3 23.93,15.3 24.9,16.27 27.43,16.27 28.45,17.3 28.45,25.15 30.25,26.95 32.73,26.95 33.92,25.75 v33.92,25.18
IO2.6  (via drill 0.3)
  Top 0.16: U3.41 34.7,25.62 v34.7,25.68
  Bottom 0.16: X4.19 17.5,5.18 22.12,7.26 RN7.5 RN7.6 22.12,10.48 20.8,11.8 20.8,14.88 21.55,15.62 23.8,15.62 24.77,16.6 27.3,16.6 28.12,17.43 28.12,25.27 30.12,27.27 32.88,27.27 34.48,25.68 v34.7,25.68
IO2.7  (via drill 0.3)
  Top 0.16: v34.42,26.6 34.65,26.6 35.52,25.73 U3.42
  Bottom 0.16: X4.20 17.5,2.95 16.48,3.98 16.48,5.18 21.32,7.26 RN7.7 RN7.8 21.32,10.8 20.48,11.65 20.48,15 21.43,15.95 23.68,15.95 24.65,16.93 27.18,16.93 27.8,17.55 27.8,25.4 30,27.6 33,27.6 34,26.6 v34.42,26.6
IO3.0  (via drill 0.3)
  Top 0.16: U3.61 40.92,35.62 40.67,35.86 v40.67,36.8
  Bottom 0.16: X5.3 33.51,45.49 34.5,44.5 34.5,43.08 34.66,42.91 38.3,42.91 41.41,39.8 RN8.7 RN8.8 41.41,37.59 40.67,36.85 v40.67,36.8
IO3.1  (via drill 0.3)
  Top 0.16: U3.60 40.4,34.82 40.05,35.17 v40.05,36.12
  Bottom 0.16: v40.05,36.12 40.05,37.05 40.61,37.61 RN8.6 RN8.5 40.61,39.8 37.84,42.58 34.17,42.58 33.5,43.25 X5.4
IO3.2  (via drill 0.3)
  Top 0.16: v39.42,36.8 39.42,34.9 40.32,34.01 U3.59
  Bottom 0.16: X5.5 31.5,45.49 32.5,44.5 32.5,43.42 33.67,42.25 37.39,42.25 39.81,39.83 RN8.3 RN8.4 39.81,37.6 39.42,37.21 v39.42,36.8
IO3.3  (via drill 0.3)
  Top 0.16: v38.8,36.12 38.8,35.02 40.6,33.22 U3.58
  Bottom 0.16: X5.6 31.5,43.42 32,43.42 33.5,41.92 36.88,41.92 39.01,39.79 RN8.1 RN8.2 39.01,37.59 38.8,37.38 v38.8,36.12
IO3.4  (via drill 0.3)
  Top 0.16: v38.17,36.8 38.17,35.12 40.89,32.41 U3.57
  Bottom 0.16: X9.1 24.46,42.49 23.95,43 23.1,43 22.5,43.6 22.5,44.58 22.93,45 24,45 24.5,45.5 24.5,46.5 25,47 26.5,47 26.79,47.29 28.21,47.29 X5.7 29.5,45.49 30.5,44.5 30.5,43.55 31.05,43 31.95,43 33.35,41.6 36.02,41.6 37.81,39.81 RN9.7 37.81,39.47 37.81,39.46 RN9.8 37.81,37.56 38.17,37.2 v38.17,36.8
IO3.5  (via drill 0.3)
  Top 0.16: v37.55,36.12 37.55,35.23 41.15,31.62 U3.56
  Bottom 0.16: X9.5 27,42.17 26.25,42.92 24.98,42.92 24.5,43.4 24.5,44.55 24.95,45 26,45 26.5,45.5 26.5,46.5 26.99,46.98 28.04,46.98 28.5,46.52 28.5,45.25 29.5,44.24 X5.8 29.57,44 30.9,42.67 31.8,42.67 33.2,41.27 35.52,41.27 37.01,39.79 RN9.5 RN9.6 37.01,37.59 37.55,37.05 v37.55,36.12
IO3.6  (via drill 0.3)
  Top 0.16: v36.92,36.8 36.92,35.38 41.47,30.83 U3.55
  Bottom 0.16: 27.5,45.49 X5.9 | 27.5,45.49 28.5,44.5 28.5,43.5 29,43 30.1,43 30.75,42.35 31.68,42.35 33.08,40.95 35.04,40.95 36.21,39.78 RN9.3 RN9.4 36.21,37.58 36.92,36.86 v36.92,36.8 | 27.52,45.49 27.52,45.5 | 27.52,45.49 27.5,45.49 | 27.52,45.49 26.5,44.48 26.5,43.52 27.02,43 27.35,43 27.66,42.69 27.66,39.39 27.52,39.25 26.4,39.25 25.73,39.92 X9.3
IO3.7  (via drill 0.3)
  Top 0.16: v36.3,36.12 36.3,35.55 41.1,30.75 41.1,30.57 41.63,30.05 U3.54
  Bottom 0.16: 29.6,42.02 29.45,42.02 29.45,42.05 X5.10 | 29.6,42.02 31.52,42.02 32.92,40.62 34.58,40.62 35.41,39.79 RN9.1 35.41,39.48 35.41,39.47 RN9.2 35.41,37.58 36.3,36.69 v36.3,36.12 | X9.9 29.54,41.97 29.6,42.02
IO4.0/PDI  (via drill 0.3, 0.3 pad 0.6)
  Top 0.15: X5.13 23.5,45.49 24.5,44.5 24.5,43.4 24.1,43 23.65,43 v23.1,42.45 | v23.1,40.8 23.4,40.8 25.5,42.9 37.1,42.9 39.51,40.49 U3.2 39.5,39.25 39.43,39.18
  Top 0.16: X3.4 45.66,16.68 47.2,16.68 47.77,17.25 47.77,22.02 v47.48,22.32 | 39.43,39.18 38.8,38.55 33.85,38.55 33.83,38.52 33.83,35.98 34.5,35.3 34.5,34.17 v35.17,33.5
  Bottom 0.15: v23.1,42.45 RN10.7 v23.1,40.8 | v23.1,40.8 RN10.8 v23.1,40.8
  Bottom 0.16: v35.17,33.5 35.17,33.08 35.62,32.62 38.77,32.62 39.05,32.9 41.52,32.9 43.35,34.73 43.35,35.67 44.1,36.42 47.25,36.42 48.35,35.33 48.35,24.15 47.48,23.27 v47.48,22.32
IO4.1/PDO  (via drill 0.3, 0.3 pad 0.6)
  Top 0.15: X5.14 23.35,43.99 v22.3,42.95 | v22.3,40.8 22.3,40.55 22.65,40.2 23.25,40.2 25.65,42.6 36.6,42.6 38.71,40.49 U3.3 38.7,39.25 38.64,39.19
  Top 0.16: X3.1 48.1,15.12 v48.1,23.02 | 38.64,39.19 38.33,38.88 33.73,38.88 33.5,38.65 33.5,35.85 34.17,35.17 34.17,34.05 34.55,33.67 34.55,33.25 34.95,32.85 35.65,32.85 v36.05,33.25
  Bottom 0.15: v22.3,42.95 RN10.5 v22.3,40.8 | v22.3,40.8 RN10.6 v22.3,40.8
  Bottom 0.16: v36.05,33.25 36.35,32.95 38.65,32.95 38.92,33.23 41.4,33.23 43,34.83 43,35.77 43.98,36.75 47.38,36.75 48.67,35.45 48.67,24.02 48.1,23.45 v48.1,23.02
IO4.2  (via drill 0.3 pad 0.6)
  Top 0.15: X5.15 20.5,45 20.5,43.5 21.25,42.75 v21.5,42.75 | U3.4 37.91,40.49 36.1,42.3 25.8,42.3 23.4,39.9 22.35,39.9 21.5,40.75 v21.5,40.8
  Bottom 0.15: v21.5,42.75 RN10.3 v21.5,40.8 | v21.5,40.8 RN10.4 v21.5,40.8
IO4.3  (via drill 0.3 pad 0.6)
  Top 0.15: U3.5 37.11,40.54 35.65,42 25.95,42 23.55,39.6 21.75,39.6 20.7,40.65 v20.7,40.8
  Bottom 0.15: X5.16 20.7,43.2 RN10.1 v20.7,40.8 | v20.7,40.8 RN10.2 v20.7,40.8
IO4.4  (via drill 0.3 pad 0.6)
  Top 0.15: U3.6 36.31,40.49 35.1,41.7 26.1,41.7 23.7,39.3 21,39.3 19.65,40.65 v19.65,40.8
  Bottom 0.15: X5.17 20.5,45 20.5,43.5 19.65,42.65 RN11.7 v19.65,40.8 | v19.65,40.8 RN11.8 v19.65,40.8
IO4.5  (via drill 0.3 pad 0.6)
  Top 0.15: U3.7 35.51,40.49 34.6,41.4 26.25,41.4 23.85,39 20.5,39 18.85,40.65 v18.85,40.8
  Bottom 0.15: X5.18 18.85,43.35 RN11.5 v18.85,40.8 | v18.85,40.8 RN11.6 v18.85,40.8
IO4.6  (via drill 0.3 pad 0.6)
  Top 0.15: U3.8 34.71,40.49 34.1,41.1 26.4,41.1 24,38.7 20.05,38.7 18.05,40.7 v18.05,40.8
  Bottom 0.15: X5.19 18.5,45 18.5,43.45 18.05,43 RN11.3 v18.05,40.8 | v18.05,40.8 RN11.4 v18.05,40.8
IO4.7  (via drill 0.3 pad 0.6)
  Top 0.15: U3.9 33.91,40.49 33.6,40.8 26.55,40.8 24.15,38.4 19.5,38.4 17.25,40.65 v17.25,40.8
  Bottom 0.15: X5.20 17.25,43.75 RN11.1 v17.25,40.8 | v17.25,40.8 RN11.2 v17.25,40.8
IRR  (via drill 0.3)
  Top 0.16: X8.2 48.42,19.52 48.42,22.02 v48.73,22.32 48.95,22.55 48.95,23.18 RN1.2 | v28.52,30.2 28.45,30.2 27.03,31.62 U3.25
  Bottom 0.16: v28.52,30.2 28.52,30.45 28.68,30.6 31.38,30.6 32.42,31.65 35.65,31.65 36.3,32.3 38.9,32.3 39.17,32.58 41.7,32.58 43.67,34.55 43.67,35.5 44.27,36.1 47.12,36.1 48,35.23 48,24.25 46.85,23.1 46.85,22.02 47.17,21.7 48.1,21.7 v48.73,22.32
KEY  (via drill 0.3)
  Top 0.16: 26.55,26.1 | 26.55,26.1 U3.32 | 26.55,26.1 26.9,26.1 27.27,25.73 27.27,20.38 v27.18,20.27
  Bottom 0.16: SW1.1 19,13.98 21.3,16.27 23.52,16.27 24.5,17.25 27.05,17.25 27.48,17.68 27.48,20.12 v27.18,20.27
LEDA  (via drill 0.3)
  Top 0.16: U4.23 20.23,19.56 20.01,19.34 18.06,19.34 v17.7,18.98 | LED1.C 15.73,29.73 15.75,29.75 v15.95,29.86
  Bottom 0.16: v17.7,18.98 17.15,18.98 16.62,19.5 16.62,29.12 v15.95,29.86
LEDB  (via drill 0.3)
  Top 0.16: U4.22 19.57,19.98 19.57,19.65 17.35,19.65 v17.24,19.76 | LED2.C | LED2.C | v17.41,30.29 17.41,29.95 LED2.C
  Bottom 0.16: v17.24,19.76 16.96,20.04 16.98,29.85 v17.41,30.29
LEDC/AUX7  (via drill 0.3)
  Top 0.16: v32.67,31.02 32.67,31.5 30.32,33.85 30.12,33.85 30.04,33.94 v29.98,33.89 29.77,34.09 29.77,35.55 28.2,37.12 26.55,37.12 26.55,37.13 U3.18 | LED3.C 21.8,29.64 v22.04,29.88
  Bottom 0.16: v32.67,31.02 32.98,31.32 35.77,31.32 36.42,31.98 39.02,31.98 39.3,32.25 41.85,32.25 44.67,35.08 | 44.67,35.08 X6.10 44.67,35.08 | 44.67,35.08 44.68,35.07 | v29.98,33.89 30.01,33.77 28.81,32.56 27.6,32.56 24.9,29.86 v22.04,29.88
MISO  (via drill 0.3)
  Top 0.16: v34.33,32.6 33.85,32.6 32.1,34.35 32.1,38 30.77,39.33 U3.13 | U4.2 25.91,21.48 v26.01,21.58
  Bottom 0.16: v26.01,21.58 26.65,22.2 26.65,24.4 26.12,24.93 26.12,25.48 26.57,25.93 26.57,29.7 28.12,31.25 29.3,31.25 30.4,32.35 34.08,32.35 v34.33,32.6
MOSI  (via drill 0.3)
  Top 0.15: U4.3 24.35,22.1 25.5,22.1 v25.68,22.27
  Top 0.16: v33.92,33.42 33.48,33.42 32.42,34.48 32.42,38.48 31.55,39.35 U3.12
  Bottom 0.16: v25.68,22.27 26.02,22.27 26.32,22.57 26.32,24.23 25.8,24.75 25.8,25.6 26.23,26.02 26.23,29.8 28,31.57 29.18,31.57 30.27,32.67 33.17,32.67 v33.92,33.42
N$4
  Top 0.16: RN2.6 14.63,30.08 15.04,30.49 16.52,30.49 16.94,30.9 17.94,30.9 18.66,31.62 18.66,31.63 LED3.A
N$7  (via drill 0.3)
  Top 0.3: v9.12,25.99 9.84,25.99 RN3.2 | RN3.4 | RN3.4 | RN3.2 | RN3.2 RN3.4 | L3.2 14.9,28.15 C12.2 v14.2,27.88
  Bottom 0.3: X2.2 3.03,21.14 3.03,21.73 3.71,22.4 4.75,22.4 5.43,23.07 5.43,25.45 5.97,25.99 v9.12,25.99 11.78,25.99 13.66,27.88 v14.2,27.88
N$8
  Top 0.3: 9.84,27.25 RN3.8 | RN3.6 9.84,27.25 | C13.2 | C13.2 | 9.84,27.25 9.84,29.04 C13.2
N$23
  Top 0.15: R6.1 31.92,18.18 32.7,17.4 35.7,17.4 36.3,16.8 36.3,16.2 U5.8
N$24
  Top 0.16: SJ2.2 31.23,11.38 32.62,11.38 R7.1
N$25
  Top 0.16: LED1.A 15.68,31.68 RN2.2
N$26
  Top 0.16: SJ3.2 39.13,11.39 R8.1
N$29
  Top 0.16: LED2.A 17.19,31.63 16.44,30.88 RN2.4
OSC1  (via drill 0.3)
  Top 0.16: v17.88,22.25 18,22.12 U4.19 | Q1.1 18.54,16.36 v18.54,17.05 18.34,17.05 C16.2
  Bottom 0.16: v18.54,17.05 18.54,19.26 18.12,19.68 18.12,20.23 17.29,21.06 17.29,21.57 17.88,22.18 v17.88,22.25
OSC2  (via drill 0.3)
  Top 0.16: v17.9,21.32 18.05,21.48 U4.20 | v20.7,18.82 20.73,18.05 20.74,18.14 Q1.3 21.18,17.95 C15.2
  Bottom 0.16: v17.9,21.32 18.45,20.77 18.45,19.8 19.43,18.82 v20.7,18.82
OW  (via drill 0.3)
  Top 0.15: 29.41,35.4 29.4,35.45 28.43,36.41 U3.19
  Top 0.16: 29.41,35.4 29.41,33.67 29.76,33.33 30.39,33.33 31.57,32.15 v31.57,31.73 | RN1.8 49,25.73 49,29.55 50.2,30.75 X7.2
  Bottom 0.16: v31.57,31.73 31.82,31.98 34.58,31.98 34.95,32.35 34.95,32.85 34.55,33.25 34.55,33.77 34.9,34.12 36.05,34.12 36.9,33.27 38.52,33.27 38.8,33.55 41.27,33.55 42.67,34.95 42.67,35.9 43.85,37.08 47.5,37.08 49,35.58 49,31.95 50.2,30.75 X7.2
RBIAS  (via drill 0.3)
  Top 0.16: v22.18,26.46 U4.10 | R5.2 24.6,17.96 24.6,18.9 v24.45,19.05
  Bottom 0.15: v22.18,26.46 22.18,26.12 24,24.3 24,19.5 v24.45,19.05
RS485A
  Top 0.16: R8.2 | R8.2 40.58,11.38 40.58,10.04 D7.1 | U6.7 40.27,13.72 40.5,13.5 | 40.5,13.5 X1.6 | R8.2 40.6,13.4 40.5,13.5
RS485B
  Top 0.16: U6.6 39.01,15.26 37.25,13.5 37,13.5 | 37,13.5 X1.5 | 37,13.5 36.79,13.46 SJ3.1 36.79,10.94 37.08,10.65 38.08,10.65 38.76,9.96 D7.2
RS485RX  (via drill 0.3)
  Top 0.16: U6.1 | v28.23,28.95 28.12,28.95 27.03,30.05 U3.27 | v41.17,20.73 41.55,21.1 U6.1
  Bottom 0.16: v28.23,28.95 28.4,28.77 29.38,28.77 29.5,28.9 34.45,28.9 35.42,27.93 39.02,27.93 39.25,28.15 39.92,28.15 40.95,27.12 40.95,26.25 39.88,25.18 39.88,22.02 v41.17,20.73
RS485TE  (via drill 0.3)
  Top 0.16: U3.29 27.1,28.47 v27.9,27.68 | U6.3 39.01,21.5 37.25,19.75 36.33,19.75 v35.7,20.38
  Bottom 0.16: v27.9,27.68 28.07,27.5 29,27.5 29.75,28.25 34.17,28.25 35.92,26.5 35.92,22.77 36.6,22.1 36.6,21.27 v35.7,20.38
RS485TX  (via drill 0.3)
  Top 0.16: U3.28 27.04,29.26 28,28.3 28.57,28.3 v28.73,28.15 | U6.4 37.73,20.71 37.4,20.38 v36.62,20.38
  Bottom 0.16: v28.73,28.15 29.2,28.15 29.62,28.57 34.33,28.57 36.25,26.65 36.25,22.9 36.92,22.23 36.92,20.68 v36.62,20.38
SCK  (via drill 0.3)
  Top 0.15: 26.25,19.85 27.2,18.9 31.8,18.9 33,17.7 36,17.7 36.5,17.2 37.65,17.2
  Top 0.16: 37.62,17.2 37.65,17.2 43.35,17.2 43.58,16.98 43.58,15.22 44.12,14.68 45.67,14.68 X3.3 | v33.55,34.27 33.12,34.27 32.77,34.62 32.77,38.73 32.34,39.16 U3.11 | U4.4 25.43,22.77 v25.7,23.05 26.57,22.3 26.57,21.02 26.25,20.7 26.25,19.85
  Bottom 0.16: v25.7,23.05 25.98,23.3 25.98,24.07 25.48,24.57 25.48,25.73 25.9,26.15 25.9,29.95 27.85,31.9 29.05,31.9 30.15,33 32.75,33 33.25,33.5 33.25,33.98 v33.55,34.27
SHLD
  Top 1: C11.2 5.65,16.2 7.59,16.2 X2.GND@2
SW3
  Top 0.5: 11.29,21.68 U2.6
  Top 1: D4.C 11.29,19.03 | 11.29,19.03 12.92,19.03 L2.2 | 11.29,19.03 C8.1 | C8.1 | C8.1 11.29,21.68
SW5
  Top 0.6: U1.6 6.21,34.3
  Top 1: L1.2 10.21,35.71 8.82,34.32 D2.C 8.73,34.29 8.72,34.3 C4.1 6.21,34.3
TPIN+  (via drill 0.3)
  Top 0.16: U4.9 22.84,26.69 22.35,27.18 20.93,27.18 20.68,26.93 12.2,26.93 11.93,27.2 RN3.5 10.89,27.2 v10.78,27.31
  Bottom 0.16: X2.4 1.75,22.62 3.92,24.79 4.17,24.79 5.98,26.6 9.7,26.6 10.41,27.31 v10.78,27.31
TPIN-  (via drill 0.3)
  Top 0.16: U4.8 23.48,26.49 22.48,27.5 20.8,27.5 20.55,27.25 12.35,27.25 11.61,28 RN3.7 11.01,28 v10.78,28.23
  Bottom 0.16: X2.6 1.86,24.93 2.04,25.11 4.04,25.11 5.83,26.91 9.49,26.91 10.56,27.99 10.78,27.99 v10.78,28.23
TPOUT+  (via drill 0.3)
  Top 0.16: U4.13 20.23,25.94 19.9,26.27 12.25,26.27 11.57,25.59 RN3.1 11.44,25.19 v11.6,25.02
  Bottom 0.16: X2.1 4.3,18.62 4.3,19.57 5.36,20.62 5.36,21.95 6.16,22.75 6.16,24.18 6.29,24.31 10.89,24.31 v11.6,25.02
TPOUT-  (via drill 0.3)
  Top 0.16: U4.12 20.89,25.82 20.1,26.6 12.12,26.6 11.92,26.39 RN3.3 11.44,26.39 11.3,26.39 10.6,25.69 v10.6,24.93
  Bottom 0.16: X2.3 4.29,21.36 5.83,22.9 5.83,24.3 6.16,24.62 10.3,24.62 v10.6,24.93
VCAP
  Top 0.16: U4.25 21.54,19.59 21.85,19.27 22.57,19.27 23.7,18.15 C14.2
VIN  (via drill 0.8 pad 1.4)
  Top 0.7: v14.5,9.5 14.5,9.1 | C3.2 16.48,8 16.5,8 16.5,9.1
  Top 0.8: X2.9 2.81,28.66
  Top 1: 15.93,13.53 D1.C | 14.5,9.1 16.5,9.1
  pour Top (isolate 0.4): 5.33,35.46 5.33,31.12 3.79,31.12 3.55,30.88 3.55,17.12 6.47,14.2 16.5,14.2 16.5,6.78 6.5,6.78 0.03,13.25 0,35.25 0.2,35.45
VSUP
  Top 0.6: D1.A 20.35,13.5 22.98,13.5 X1.1
  Top 1: D1.A | D1.A | C1.2 18.93,13.53 D1.A
XTAL1
  Top 0.15: SJ1.2 21.91,31.64 22.5,31.05 23.95,31.05 24.88,30.12 Q2.1
  Top 0.16: U3.24 25.96,32.41 25.65,32.1 25.65,31.27 24.88,30.5 24.88,30.12 24.75,30 24.79,29.96 | Q2.1 24.79,29.96 | C18.2 24.73,28.6 24.79,28.66 24.79,29.96
XTAL2
  Top 0.16: 23.08,31.75 Q2.3 23.36,32.16 24.73,33.52 C17.2 25.2,33.2 U3.23

### Text on the board
bStop: sautter.com